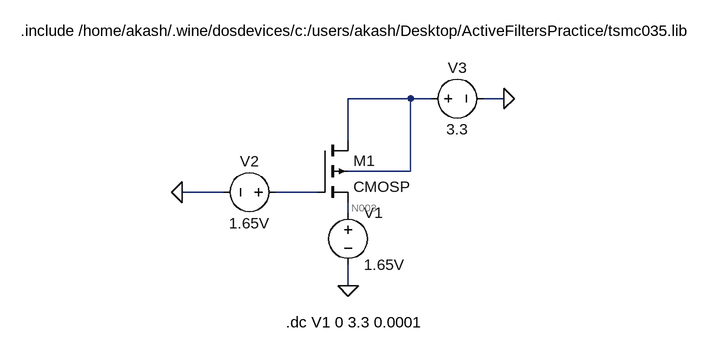
[diagram p0: schematic TSMC250nm.asc]
TSMC250nm.asc, the LTspice schematic file:
Version 4
SHEET 1 1260 4660
WIRE 496 64 400 64
WIRE 528 64 496 64
WIRE 640 64 608 64
WIRE 400 128 400 64
WIRE 496 176 496 64
WIRE 496 176 400 176
WIRE 208 208 144 208
WIRE 352 208 288 208
WIRE 400 240 400 224
WIRE 400 352 400 320
FLAG 400 352 0
FLAG 144 208 0
FLAG 640 64 0
SYMBOL pmos4 352 128 R0
SYMATTR InstName M1
SYMATTR Value CMOSP
SYMATTR Value2 l=0.5u w=50u
SYMBOL voltage 400 224 R0
WINDOW 123 0 0 Left 0
WINDOW 39 0 0 Left 0
SYMATTR InstName V1
SYMATTR Value 1.65V
SYMBOL voltage 304 208 R90
WINDOW 0 -32 56 VBottom 2
WINDOW 3 32 56 VTop 2
WINDOW 123 0 0 Left 0
WINDOW 39 0 0 Left 0
SYMATTR InstName V2
SYMATTR Value 1.65V
SYMBOL voltage 512 64 R270
WINDOW 0 32 56 VTop 2
WINDOW 3 -32 56 VBottom 2
WINDOW 123 0 0 Left 0
WINDOW 39 0 0 Left 0
SYMATTR InstName V3
SYMATTR Value 3.3
TEXT 304 408 Left 2 !.dc V1 0 3.3 0.0001
TEXT -104 -40 Left 2 !.include /home/akash/.wine/dosdevices/c:/users/akash/Desktop/ActiveFiltersPractice/tsmc035.lib

The netlist it stands for:
* TSMC250nm.asc
M1 N001 N002 N003 N001 CMOSP l=0.5u w=50u
V1 N003 0 1.65V
V2 N002 0 1.65V
V3 N001 0 3.3
.model NMOS NMOS
.model PMOS PMOS
.lib standard.mos
.dc V1 0 3.3 0.0001
.include /home/akash/.wine/dosdevices/c:/users/akash/Desktop/ActiveFiltersPractice/tsmc035.lib
.backanno
.end

* Results of the author's LTspice run, read from the files saved beside the schematic
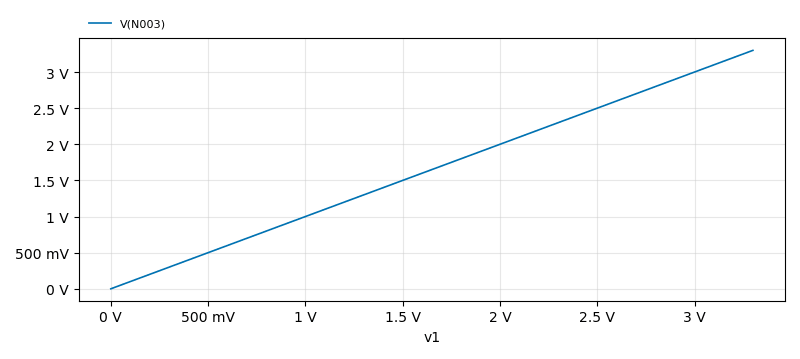
[diagram p1: DC transfer characteristic of TSMC250nm.asc, plotted from the saved traces]
* DC transfer characteristic, 1 run:
*   V(N003): 0 V at v1=0 V, 3.3 V at v1=3.3 V, min 0 V, max 3.3 V